# Altium schematic sheet spectrum_8kHz_64Hz.SchDoc
size A4; SheetNumber: 2; SheetTotal: 6
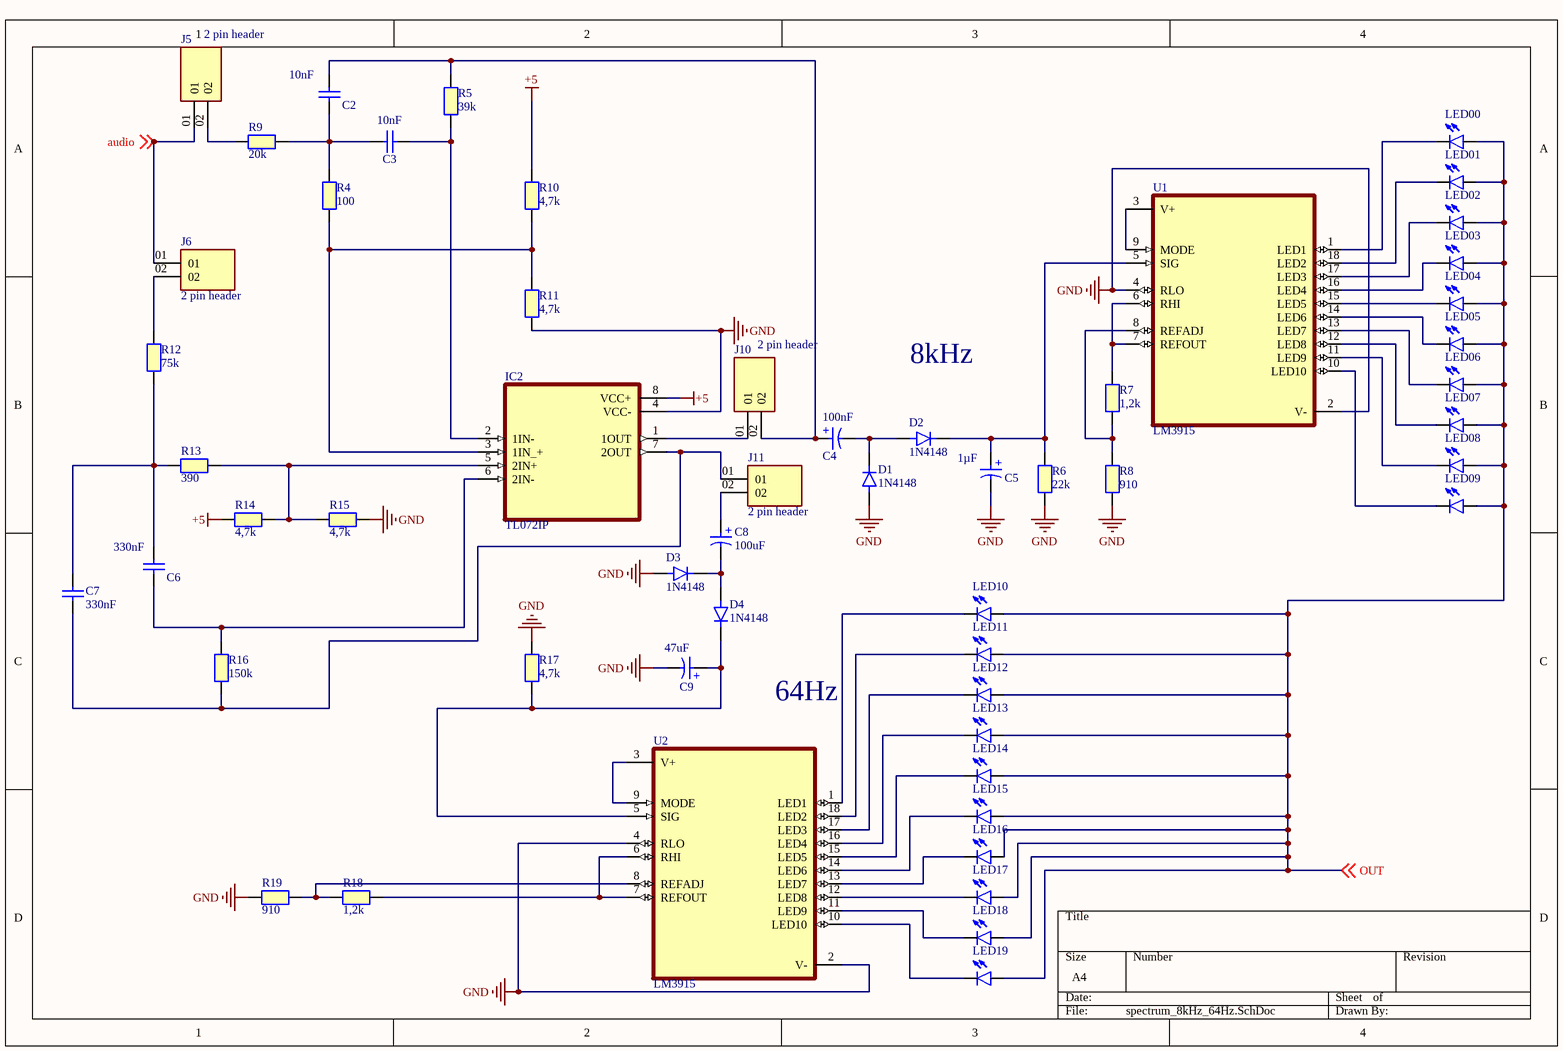
[diagram p0: spectrum_8kHz_64Hz.SchDoc]

## Parts
C2  10nF  [CAPC2012X65N]
C3  10nF  [CAPC2012X65N]
C4  100nF  [WCAP-ATG8_D5H11]
C5  1µF  [WCAP-ATG8_D5H11]
C6  330nF  [CAPC2012X65N]
C7  330nF  [CAPC2012X65N]
C8  100uF  [WCAP-ATG8_D5H11]
C9  47uF  [WCAP-ATG8_D5H11]
D1  1N4148  [DIOAD829W49L456D191]
D2  1N4148  [DIOAD829W49L456D191]
D3  1N4148  [DIOAD829W49L456D191]
D4  1N4148  [DIOAD829W49L456D191]
IC2  TL072IP  [DIP794W45P254L959H508Q8]
J5  2 pin header  [SAMTEC_HTSW-102-07-TM-S]
J6  2 pin header  [SAMTEC_HTSW-102-07-TM-S]
J10  2 pin header  [SAMTEC_HTSW-102-07-TM-S]
J11  2 pin header  [SAMTEC_HTSW-102-07-TM-S]
LED00  LED 2x3x4  [LED 2x3x4mm]  (value not drawn)
LED01  LED 2x3x4  [LED 2x3x4mm]  (value not drawn)
LED02  LED 2x3x4  [LED 2x3x4mm]  (value not drawn)
LED03  LED 2x3x4  [LED 2x3x4mm]  (value not drawn)
LED04  LED 2x3x4  [LED 2x3x4mm]  (value not drawn)
LED05  LED 2x3x4  [LED 2x3x4mm]  (value not drawn)
LED06  LED 2x3x4  [LED 2x3x4mm]  (value not drawn)
LED07  LED 2x3x4  [LED 2x3x4mm]  (value not drawn)
LED08  LED 2x3x4  [LED 2x3x4mm]  (value not drawn)
LED09  LED 2x3x4  [LED 2x3x4mm]  (value not drawn)
LED10  LED 2x3x4  [LED 2x3x4mm]  (value not drawn)
LED11  LED 2x3x4  [LED 2x3x4mm]  (value not drawn)
LED12  LED 2x3x4  [LED 2x3x4mm]  (value not drawn)
LED13  LED 2x3x4  [LED 2x3x4mm]  (value not drawn)
LED14  LED 2x3x4  [LED 2x3x4mm]  (value not drawn)
LED15  LED 2x3x4  [LED 2x3x4mm]  (value not drawn)
LED16  LED 2x3x4  [LED 2x3x4mm]  (value not drawn)
LED17  LED 2x3x4  [LED 2x3x4mm]  (value not drawn)
LED18  LED 2x3x4  [LED 2x3x4mm]  (value not drawn)
LED19  LED 2x3x4  [LED 2x3x4mm]  (value not drawn)
R4  100  [RESC2012X50N]
R5  39k  [RESC2012X50N]
R6  22k  [RESC2012X50N]
R7  1,2k  [RESC2012X50N]
R8  910  [RESC2012X50N]
R9  20k  [RESC2012X50N]
R10  4,7k  [RESC2012X50N]
R11  4,7k  [RESC2012X50N]
R12  75k  [RESC2012X50N]
R13  390  [RESC2012X50N]
R14  4,7k  [RESC2012X50N]
R15  4,7k  [RESC2012X50N]
R16  150k  [RESC2012X50N]
R17  4,7k  [RESC2012X50N]
R18  1,2k  [RESC2012X50N]
R19  910  [RESC2012X50N]
U1  LM3915  [DIP952W45P254L2336H533Q18]
U2  LM3915  [DIP952W45P254L2336H533Q18]

## Nets
+5: IC2.8(VCC+) R10.2 R14.2
GND: C5.2(N) C9.2(N) D1.A D3.A IC2.4(VCC-) R6.1 R8.2 R11.1 R15.2 R17.1 R19.2 U1.2(V-) U1.4(RLO) U2.2(V-) U2.4(RLO)
audio: J5.01 J6.01 ; off-sheet audio
OUT: LED00.A LED01.A LED02.A LED03.A LED04.A LED05.A LED06.A LED07.A LED08.A LED09.A LED10.A LED11.A LED12.A LED13.A LED14.A LED15.A LED16.A LED17.A LED18.A LED19.A ; off-sheet OUT
NetC2_1: C2.1 C3.1 R4.2 R9.2
NetC2_2: C2.2 C4.1(P) J10.02 R5.2
NetC3_2: C3.2 IC2.2(1IN-) R5.1
NetC4_2: C4.2(N) D1.C D2.A
NetC5_1: C5.1(P) D2.C R6.2 U1.5(SIG)
NetC6_1: C6.1 IC2.6(2IN-) R16.2
NetC6_2: C6.2 C7.2 R12.1 R13.2
NetC7_1: C7.1 IC2.7(2OUT) J11.01 R16.1
NetC8_1: C8.1(P) J11.02
NetC8_2: C8.2(N) D3.C D4.A
NetC9_1: C9.1(P) D4.C R17.2 U2.5(SIG)
NetIC2_1: IC2.1(1OUT) J10.01
NetIC2_3: IC2.3(1IN_+) R4.1 R10.1 R11.2
NetIC2_5: IC2.5(2IN+) R13.1 R14.1 R15.1
NetJ5_02: J5.02 R9.1
NetJ6_02: J6.02 R12.2
NetLED00_K: LED00.K(C) U1.1(LED1)
NetLED01_K: LED01.K(C) U1.18(LED2)
NetLED02_K: LED02.K(C) U1.17(LED3)
NetLED03_K: LED03.K(C) U1.16(LED4)
NetLED04_K: LED04.K(C) U1.15(LED5)
NetLED05_K: LED05.K(C) U1.14(LED6)
NetLED06_K: LED06.K(C) U1.13(LED7)
NetLED07_K: LED07.K(C) U1.12(LED8)
NetLED08_K: LED08.K(C) U1.11(LED9)
NetLED09_K: LED09.K(C) U1.10(LED10)
NetLED10_K: LED10.K(C) U2.1(LED1)
NetLED11_K: LED11.K(C) U2.18(LED2)
NetLED12_K: LED12.K(C) U2.17(LED3)
NetLED13_K: LED13.K(C) U2.16(LED4)
NetLED14_K: LED14.K(C) U2.15(LED5)
NetLED15_K: LED15.K(C) U2.14(LED6)
NetLED16_K: LED16.K(C) U2.13(LED7)
NetLED17_K: LED17.K(C) U2.12(LED8)
NetLED18_K: LED18.K(C) U2.11(LED9)
NetLED19_K: LED19.K(C) U2.10(LED10)
NetR7_1: R7.1 U1.6(RHI) U1.7(REFOUT)
NetR7_2: R7.2 R8.1 U1.8(REFADJ)
NetR18_1: R18.1 U2.6(RHI) U2.7(REFOUT)
NetR18_2: R18.2 R19.1 U2.8(REFADJ)
NetU1_3: U1.3(V+) U1.9(MODE)
NetU2_3: U2.3(V+) U2.9(MODE)

## Notes on the sheet
- 8kHz
- 64Hz
- (in symbol 860010272005) +

## Library data of the parts
C2 C3 = 885012004008: 10nF ceramic; Manufacturer: Wurth Elektronik; Match Code: WCAP-CSGP; Case/Size Code: 0201; Capacitance: 22pF; Capacitance Tolerance: +/-5%; Ceramic Type: NP0 Class I; Insulation Resistance: 10GΩ; Q Factor: 840; Rated Voltage (DC): 25V; Technical Reference: NP00201220J025DFCT10000; Manufacturer Part Number: 885012004008; Category: Multilayer Ceramic Chip Capacitors; ComponentLink1Description: Website Link; ComponentLink1URL: https://www.we-online.com/redexpert/article/885012004008?ad; ComponentLink2Description: Datasheet Link; ComponentLink2URL: https://www.we-online.com/redexpert/spec/885012004008?ad; Mount: Surface Mount; Operating Temperature Max: 125°C; Operating Temperature Min: -55°C; Packaging: Tape and Reel; Length: 0.6mm; Width: 0.3mm; Height: 0.3mm
C4 = 860010272005: Elco 100nF; Manufacturer: Wurth Elektronik; Match Code: WCAP-ATG8; Capacitance: 100µF; Capacitance Tolerance: +/-20%; Dissipation Factor: 19%; Endurance: 2000h; Leakage Current: 10µA; Rated Voltage (DC): 10V; Ripple Current: 198mA; Technical Reference: ATBC110101M010DSPA3B000; Manufacturer Part Number: 860010272005; Category: Aluminum Electrolytic Capacitors; ComponentLink1Description: Website Link; ComponentLink1URL: https://www.we-online.com/redexpert/article/860010272005?ad; ComponentLink2Description: Datasheet Link; ComponentLink2URL: https://www.we-online.com/redexpert/spec/860010272005?ad; Mount: Through Hole; Operating Temperature Max: 85°C; Operating Temperature Min: -40°C; Packaging: Ammo Pack; Height: 11mm; Diameter: 5mm
C5 = 860010272005: WCAP-ATG8 Aluminum Electrolytic Capacitor, Radial, THT, D5 x H11mm, 1uF, 10V; Manufacturer: Wurth Elektronik; Capacitance: 100µF; Capacitance Tolerance: +/-20%; Dissipation Factor: 19%; Endurance: 2000h; Leakage Current: 10µA; Ripple Current: 198mA; Technical Reference: ATBC110101M010DSPA3B000; Manufacturer Part Number: 860010272005; Category: Aluminum Electrolytic Capacitors; Match Code: WCAP-ATG8; ComponentLink1Description: Website Link; ComponentLink1URL: https://www.we-online.com/redexpert/article/860010272005?ad; ComponentLink2Description: Datasheet Link; ComponentLink2URL: https://www.we-online.com/redexpert/spec/860010272005?ad; Mount: Through Hole; Operating Temperature Max: 85°C; Operating Temperature Min: -40°C; Packaging: Ammo Pack; Height: 11mm; Diameter: 5mm; Rated Voltage (DC): 10V
C6 C7 = 885012004008: 330nF ceramic; Manufacturer: Wurth Elektronik; Match Code: WCAP-CSGP; Case/Size Code: 0201; Capacitance: 22pF; Capacitance Tolerance: +/-5%; Ceramic Type: NP0 Class I; Insulation Resistance: 10GΩ; Q Factor: 840; Rated Voltage (DC): 25V; Technical Reference: NP00201220J025DFCT10000; Manufacturer Part Number: 885012004008; Category: Multilayer Ceramic Chip Capacitors; ComponentLink1Description: Website Link; ComponentLink1URL: https://www.we-online.com/redexpert/article/885012004008?ad; ComponentLink2Description: Datasheet Link; ComponentLink2URL: https://www.we-online.com/redexpert/spec/885012004008?ad; Mount: Surface Mount; Operating Temperature Max: 125°C; Operating Temperature Min: -55°C; Packaging: Tape and Reel; Length: 0.6mm; Width: 0.3mm; Height: 0.3mm
C8 = 860010272005: Elco 100uF; Manufacturer: Wurth Elektronik; Match Code: WCAP-ATG8; Capacitance: 100µF; Capacitance Tolerance: +/-20%; Dissipation Factor: 19%; Endurance: 2000h; Leakage Current: 10µA; Rated Voltage (DC): 10V; Ripple Current: 198mA; Technical Reference: ATBC110101M010DSPA3B000; Manufacturer Part Number: 860010272005; Category: Aluminum Electrolytic Capacitors; ComponentLink1Description: Website Link; ComponentLink1URL: https://www.we-online.com/redexpert/article/860010272005?ad; ComponentLink2Description: Datasheet Link; ComponentLink2URL: https://www.we-online.com/redexpert/spec/860010272005?ad; Mount: Through Hole; Operating Temperature Max: 85°C; Operating Temperature Min: -40°C; Packaging: Ammo Pack; Height: 11mm; Diameter: 5mm
C9 = 860010272005: WCAP-ATG8 Aluminum Electrolytic Capacitor, Radial, THT, D5 x H11mm, 47µF, 10V; Manufacturer: Wurth Elektronik; Capacitance: 100µF; Capacitance Tolerance: +/-20%; Dissipation Factor: 19%; Endurance: 2000h; Leakage Current: 10µA; Ripple Current: 198mA; Technical Reference: ATBC110101M010DSPA3B000; Manufacturer Part Number: 860010272005; Category: Aluminum Electrolytic Capacitors; Match Code: WCAP-ATG8; ComponentLink1Description: Website Link; ComponentLink1URL: https://www.we-online.com/redexpert/article/860010272005?ad; ComponentLink2Description: Datasheet Link; ComponentLink2URL: https://www.we-online.com/redexpert/spec/860010272005?ad; Mount: Through Hole; Operating Temperature Max: 85°C; Operating Temperature Min: -40°C; Packaging: Ammo Pack; Height: 11mm; Diameter: 5mm; Rated Voltage (DC): 10V
D1-D4 = 1N4148: Diode Standard 75V 200mA Surface Mount SOD-523F; MF: ON Semiconductor; Price: None; Availability: In Stock; Package: AXIAL LEAD-2 ON Semiconductor; MP: 1N4148; Value: *; SnapEDA_Link: https://www.snapeda.com/parts/1N4148/Onsemi/view-part/?ref=snap; Purchase-URL: https://pricing.snapeda.com/search/part/1N4148/?ref=eda; Check_prices: https://www.snapeda.com/parts/1N4148/Onsemi/view-part/?ref=eda
IC2 = TL072IP: Dual, 30-V, 3-MHz, high slew rate (13-V/Âµs), In to V+, JFET-input op amp; MF: Texas Instruments; Price: None; Package: PDIP-8 Texas; Purchase-URL: https://pricing.snapeda.com/search/part/TL072IP/?ref=eda; Availability: In Stock; SnapEDA_Link: https://www.snapeda.com/parts/TL072IP/Texas+Instruments/view-part/?ref=snap; Value: *; MP: TL072IP; Check_prices: https://www.snapeda.com/parts/TL072IP/Texas+Instruments/view-part/?ref=eda
J5 J6 J10 J11 = 2 pin header: 2 pin header Jumper; MP: HTSW10207TMS; MF: Samtec; SnapEDA_Link: https://www.snapeda.com/parts/HTSW10207TMS/Samtec/view-part/?ref=snap; Value: *; Purchase-URL: https://pricing.snapeda.com/search/part/HTSW10207TMS/?ref=eda; Availability: In Stock; Check_prices: https://www.snapeda.com/parts/HTSW10207TMS/Samtec/view-part/?ref=eda; Package: None; Price: None
LED00 LED01 LED02 LED03 LED04 LED05 LED06 LED07 LED08 LED09-LED19 = LED 2x3x4: Green 569nm LED Indication - Discrete 1.9V Radial; MP: TLLG4400; MF: Vishay Semiconductors; SnapEDA_Link: https://www.snapeda.com/parts/TLLG4400/Vishay/view-part/?ref=snap; Availability: In Stock; Package: None; Check_prices: https://www.snapeda.com/parts/TLLG4400/Vishay/view-part/?ref=eda; Value: *; Purchase-URL: https://pricing.snapeda.com/search/part/TLLG4400/?ref=eda; Price: None
R4 = RESISTOR 0805: 100Ohm Resistor 0805; Part Number: TNPW080510K0BETA; Manufacturer: Vishay Dale
R5 R10 R11 R14 R15 R17 = RESISTOR 0805: 4,7k Resistor 0805; Part Number: TNPW080510K0BETA; Manufacturer: Vishay Dale
R6 = RESISTOR 0805: 22k Resistor 0805; Part Number: TNPW080510K0BETA; Manufacturer: Vishay Dale
R7 R18 = RESISTOR 0805: 1,2k Resistor 0805; Part Number: TNPW080510K0BETA; Manufacturer: Vishay Dale
R8 R19 = RESISTOR 0805: 910 Resistor 0805; Part Number: TNPW080510K0BETA; Manufacturer: Vishay Dale
R9 = RESISTOR 0805: 20k Resistor 0805; Part Number: TNPW080510K0BETA; Manufacturer: Vishay Dale
R12 = RESISTOR 0805: 75k Resistor 0805; Part Number: TNPW080510K0BETA; Manufacturer: Vishay Dale
R13 = RESISTOR 0805: 390 Resistor 0805; Part Number: TNPW080510K0BETA; Manufacturer: Vishay Dale
R16 = RESISTOR 0805: 150k Resistor 0805; Part Number: TNPW080510K0BETA; Manufacturer: Vishay Dale
U1 U2 = LM3915: MP: LM3914N-1; Package: None; Availability: Unavailable; Price: None; Value: *